# EAGLE design ArcadeTouchPanel5 (EAGLE 9.6.2)
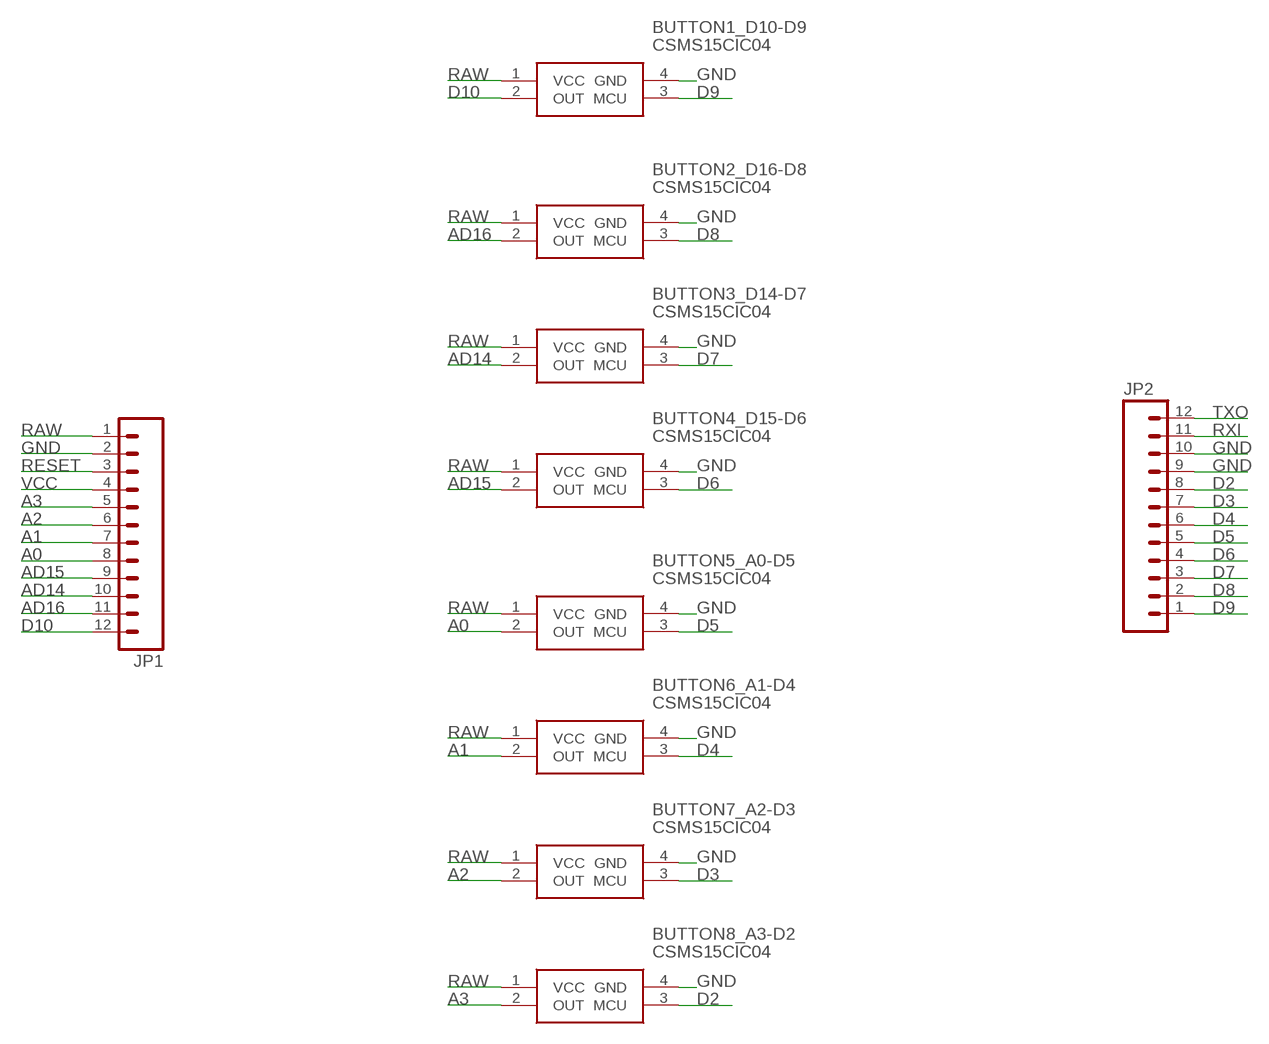
[diagram p0: schematic, sheet 1]

## Parts
BUTTON1_D10-D9  CSMS15CIC04  [CSMS15CIC04]
BUTTON2_D16-D8  CSMS15CIC04  [CSMS15CIC04]
BUTTON3_D14-D7  CSMS15CIC04  [CSMS15CIC04]
BUTTON4_D15-D6  CSMS15CIC04  [CSMS15CIC04]
BUTTON5_A0-D5  CSMS15CIC04  [CSMS15CIC04]
BUTTON6_A1-D4  CSMS15CIC04  [CSMS15CIC04]
BUTTON7_A2-D3  CSMS15CIC04  [CSMS15CIC04]
BUTTON8_A3-D2  CSMS15CIC04  [CSMS15CIC04]
JP1  M12PTH  [1X12]
JP2  M12PTH  [1X12]

## Nets
A0: BUTTON5_A0-D5.2(OUT) JP1.8
A1: BUTTON6_A1-D4.2(OUT) JP1.7
A2: BUTTON7_A2-D3.2(OUT) JP1.6
A3: BUTTON8_A3-D2.2(OUT) JP1.5
AD14: BUTTON3_D14-D7.2(OUT) JP1.10
AD15: BUTTON4_D15-D6.2(OUT) JP1.9
AD16: BUTTON2_D16-D8.2(OUT) JP1.11
D2: BUTTON8_A3-D2.3(MCU) JP2.8
D3: BUTTON7_A2-D3.3(MCU) JP2.7
D4: BUTTON6_A1-D4.3(MCU) JP2.6
D5: BUTTON5_A0-D5.3(MCU) JP2.5
D6: BUTTON4_D15-D6.3(MCU) JP2.4
D7: BUTTON3_D14-D7.3(MCU) JP2.3
D8: BUTTON2_D16-D8.3(MCU) JP2.2
D9: BUTTON1_D10-D9.3(MCU) JP2.1
D10: BUTTON1_D10-D9.2(OUT) JP1.12
GND [vcc]: BUTTON1_D10-D9.4(GND) BUTTON2_D16-D8.4(GND) BUTTON3_D14-D7.4(GND) BUTTON4_D15-D6.4(GND) BUTTON5_A0-D5.4(GND) BUTTON6_A1-D4.4(GND) BUTTON7_A2-D3.4(GND) BUTTON8_A3-D2.4(GND) JP1.2 JP2.9 JP2.10
RAW [vcc]: BUTTON1_D10-D9.1(VCC) BUTTON2_D16-D8.1(VCC) BUTTON3_D14-D7.1(VCC) BUTTON4_D15-D6.1(VCC) BUTTON5_A0-D5.1(VCC) BUTTON6_A1-D4.1(VCC) BUTTON7_A2-D3.1(VCC) BUTTON8_A3-D2.1(VCC) JP1.1
RESET: JP1.3
RXI: JP2.11
TXO: JP2.12
VCC: JP1.4

## Library data of the parts
BUTTON1_D10-D9 BUTTON2_D16-D8 BUTTON3_D14-D7 BUTTON4_D15-D6 BUTTON5_A0-D5 BUTTON6_A1-D4 BUTTON7_A2-D3 BUTTON8_A3-D2 = SamacSys_Parts:CSMS15CIC04: VCC (VISUAL COMMUNICATIONS COMPANY) - CSMS15CIC04 - CAPACITIVE TOUCH SENSOR DISPLAY, WHITE Source: Datasheet <https://www.vcclite.com/wp-content/uploads/wpallimport/files/files/CSMS15CIC04.pdf>; DESCRIPTION: VCC (VISUAL COMMUNICATIONS COMPANY) - CSMS15CIC04 - CAPACITIVE TOUCH SENSOR DISPLAY, WHITE; HEIGHT: 3.2mm; MANUFACTURER_NAME: Visual Communications Company; MANUFACTURER_PART_NUMBER: CSMS15CIC04; MOUSER_PART_NUMBER: 593-CSMS15CIC04; MOUSER_PRICE-STOCK: https://www.mouser.co.uk/ProductDetail/VCC/CSMS15CIC04?qs=rrS6PyfT74cZ9SgyWmzvNQ%3D%3D
JP1 JP2 = SparkFun:M12: Header 12 Standard 12-pin 0.1" header. Use with straight break away headers (SKU : PRT-00116), right angle break away headers (PRT-00553), swiss pins (PRT-00743), machine pins (PRT-00117), and female headers (PRT-00115).

## Net classes
0 default: width 0.203 mm

## Board
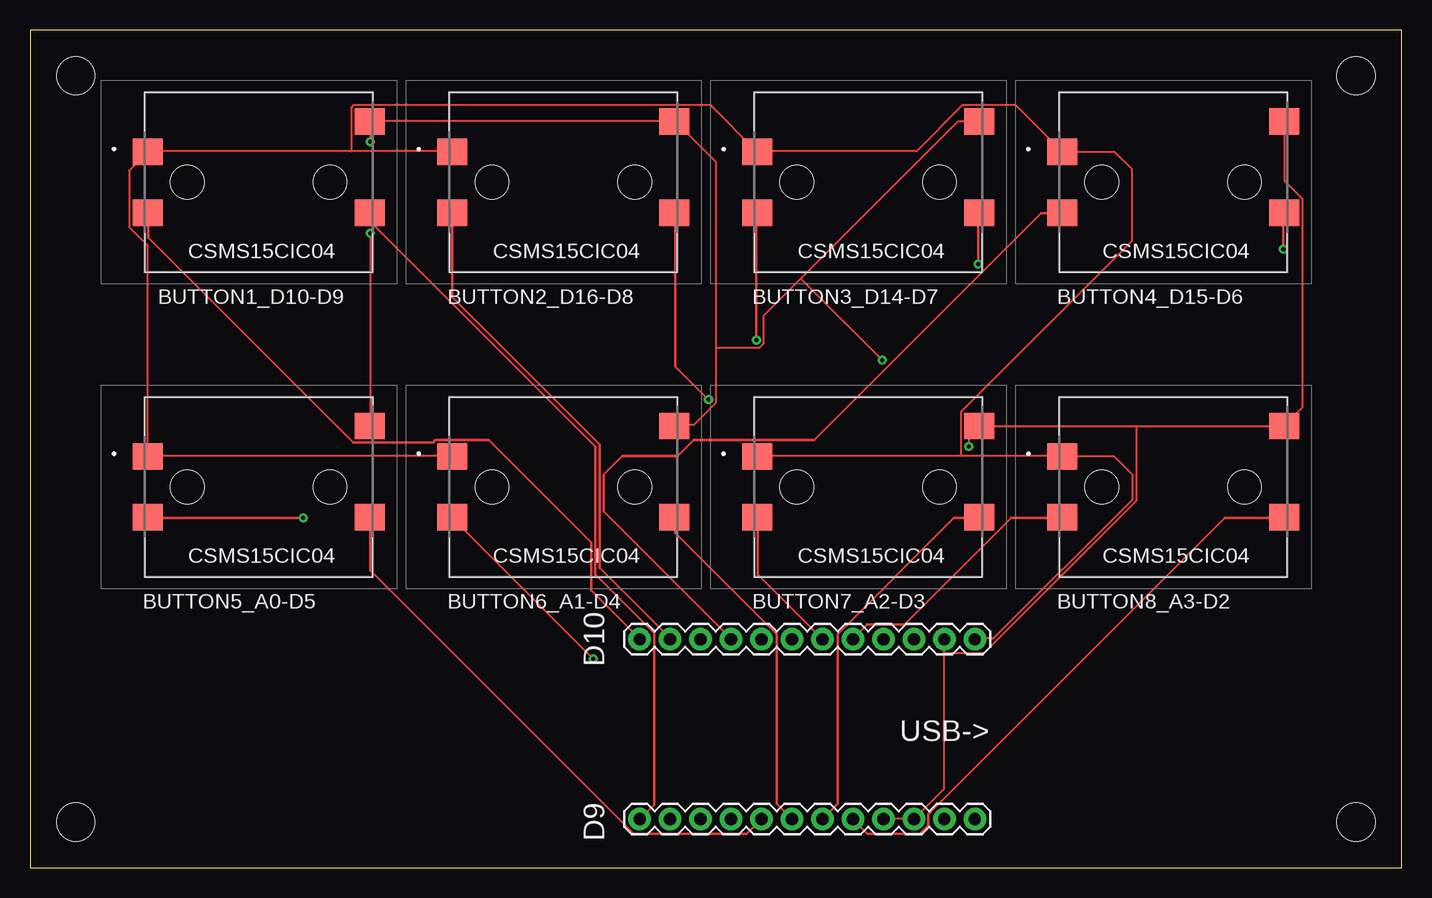
[diagram p1: board, top side]
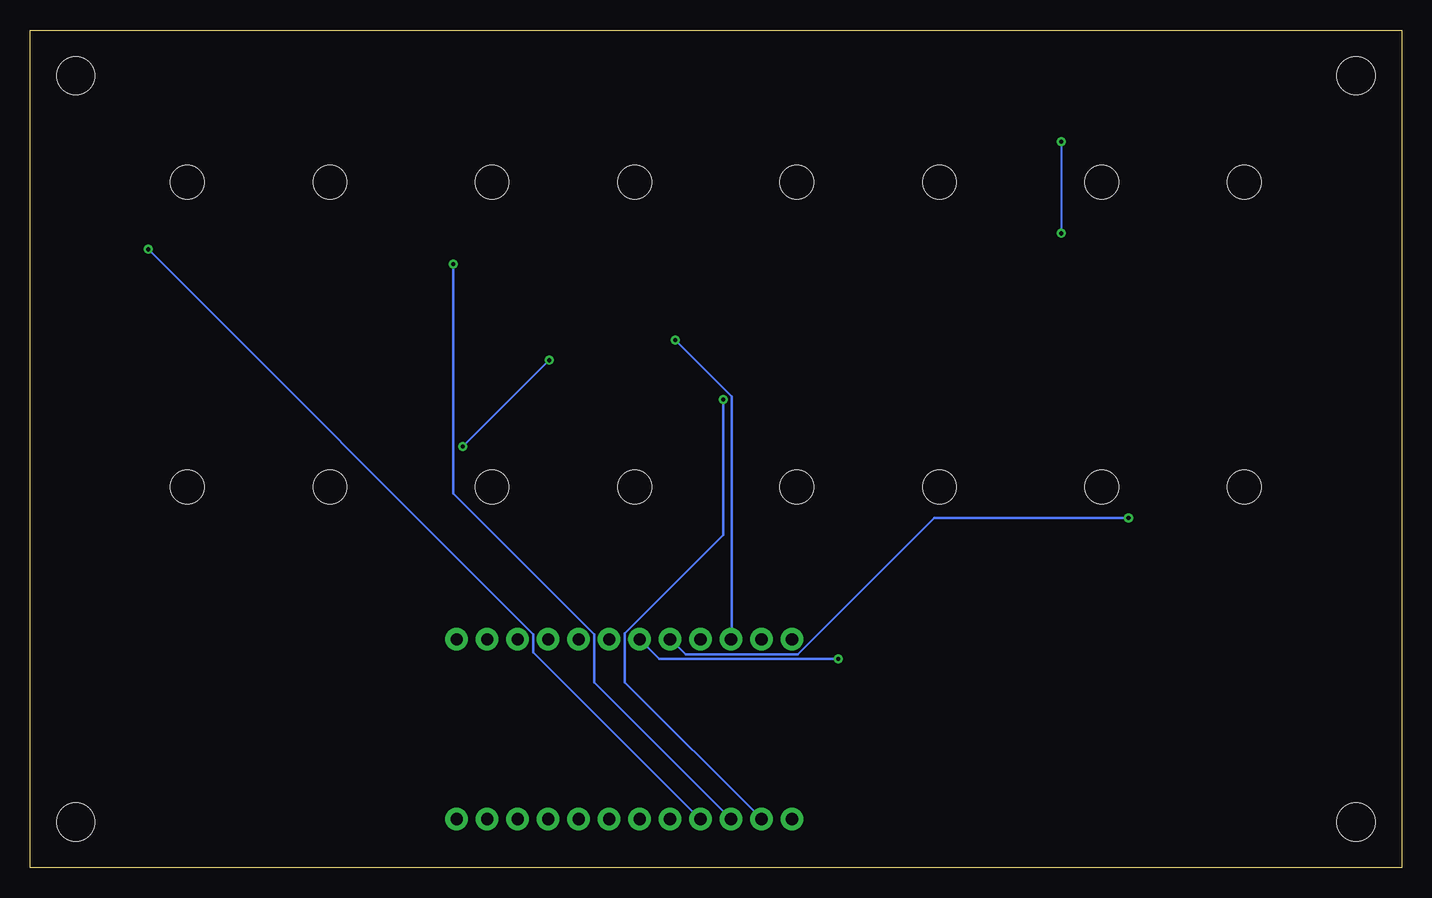
[diagram p2: board, bottom side, seen from below]

Size 114.3 x 69.85 mm. Coordinates in mm from the lower left corner, seen from the top.
Outline: 0,0 114.3,0 114.3,69.85 0,69.85 0,0
Copper layers (1*16): Top 0.035mm / dielectric 1.5mm / Bottom 0.035mm
Design rules "default": minimum track width 6mil, minimum drill 0.35mm, track to track 6mil, track to pad 6mil, pad to pad 6mil, via to via 6mil, smd to smd 6mil, copper to edge 40mil, drill to drill 6mil, minimum pad ring 10mil, minimum via ring 8mil, stop-mask expansion 4mil, vias tented up to drill 0mil, thermal gap 10mil
Holes 3.17 mm at 3.81,66.04 110.49,66.04 110.49,3.81 3.81,3.81

### Footprints (pad centres in the part's own frame; a part is rotated, then mirrored left to right if it is on the bottom)
CSMS15CIC04 = smd 2.5 x 2.2: 1 -9.25,2.54; 2 -9.25,-2.54; 3 9.25,-2.54; 4 9.25,5.08 | hole 2.8: -5.95,0; 5.95,0
1X12 = drill 1.016 pad 1.88: 1 0,0; 2 2.54,0; 3 5.08,0; 4 7.62,0; 5 10.16,0; 6 12.7,0; 7 15.24,0; 8 17.78,0; 9 20.32,0; 10 22.86,0; 11 25.4,0; 12 27.94,0

### Placement (x,y rotation side)
BUTTON1_D10-D9  19.05,57.15 0 top
BUTTON2_D16-D8  44.45,57.15 0 top
BUTTON3_D14-D7  69.85,57.15 0 top
BUTTON4_D15-D6  95.25,57.15 0 top
BUTTON5_A0-D5  19.05,31.75 0 top
BUTTON6_A1-D4  44.45,31.75 0 top
BUTTON7_A2-D3  69.85,31.75 0 top
BUTTON8_A3-D2  95.25,31.75 0 top
JP1  78.74,19.05 180 top
JP2  50.8,4.06 0 top

### Tracks (layer width: path | path; a pad name or v marks a point on that pad's centre or on a via)
A0  (via drill 0.35)
  Top 0.203: v22.76,29.16 9.87,29.16 BUTTON5_A0-D5.2
  Bottom 0.203: v22.76,29.16 38.94,29.16 50.32,17.78 59.65,17.78 60.9,19.02 JP1.8
A1  (via drill 0.35)
  Top 0.203: v46.94,17.42 35.2,29.16 BUTTON6_A1-D4.2
  Bottom 0.203: v46.94,17.42 61.87,17.42 JP1.7
A2
  Top 0.203: BUTTON7_A2-D3.2 60.63,29.16 60.63,24.45 65.96,19.11 JP1.6
A3
  Top 0.203: BUTTON8_A3-D2.2 85.97,29.16 81.79,29.16 72.9,20.27 69.79,20.27 68.63,19.11 JP1.5
AD14  (via drill 0.35)
  Top 0.203: v60.54,44.01 60.54,54.59 BUTTON3_D14-D7.2
  Bottom 0.203: v60.54,44.01 55.83,39.29 55.83,19.11 JP1.10
AD15
  Top 0.203: BUTTON4_D15-D6.2 85.97,54.59 84.28,54.59 65.34,35.65 55.3,35.65 53.96,34.31 49.34,34.31 47.83,32.8 47.83,29.69 58.41,19.11 JP1.9
AD16
  Top 0.203: BUTTON2_D16-D8.2 35.2,54.59 35.2,47.56 47.47,35.29 47.47,24.98 53.34,19.11 JP1.11
D2
  Top 0.203: BUTTON8_A3-D2.3 104.46,29.16 99.57,29.16 74.85,4.45 74.85,3.56 74.14,2.85 69.79,2.85 68.63,4 JP2.8
D3
  Top 0.203: BUTTON7_A2-D3.3 79.03,29.16 76.99,29.16 67.3,19.47 67.3,5.33 66.05,4.09 JP2.7
D4
  Top 0.203: JP2.6 62.23,5.33 62.23,19.47 53.78,27.91 53.78,29.16 BUTTON6_A1-D4.3
D5
  Top 0.203: JP2.5 59.74,2.85 50.32,2.85 28.36,24.8 28.36,29.16 BUTTON5_A0-D5.3
D6  (via drill 0.35)
  Top 0.203: v104.46,51.56 104.46,54.59 BUTTON4_D15-D6.3
  Bottom 0.203: v104.46,51.56 72.36,19.47 72.36,17.96 58.5,4.09 JP2.4
D7  (via drill 0.35)
  Top 0.203: v79.03,50.32 79.03,54.59 BUTTON3_D14-D7.3
  Bottom 0.203: v79.03,50.32 79.03,31.2 67.3,19.47 67.3,15.47 55.92,4.09 JP2.3
D8  (via drill 0.35)
  Top 0.203: v56.54,39.03 53.78,41.78 53.78,54.59 BUTTON2_D16-D8.3
  Bottom 0.203: v56.54,39.03 56.54,27.74 64.72,19.56 64.72,15.47 53.34,4.09 JP2.2
D9
  Top 0.203: BUTTON1_D10-D9.3 28.36,54.59 28.36,53.87 47.12,35.12 47.12,24.45 52.01,19.56 52.01,5.25 50.85,4.09 JP2.1
D10
  Top 0.203: BUTTON1_D10-D9.2 9.87,54.59 9.87,52.54 26.94,35.47 33.6,35.47 33.78,35.65 38.23,35.65 46.76,27.11 46.76,23.11 50.76,19.11 JP1.12
GND  (via drill 0.35)
  Top 0.152: v28.36,52.9 28.36,36.89 BUTTON5_A0-D5.4 | 28.36,62.23 v28.36,60.54 | 57.16,43.38 57.16,58.85 53.78,62.23 BUTTON2_D16-D8.4 28.36,62.23 | 57.16,43.38 57.16,38.76 55.3,36.89 53.78,36.89 BUTTON6_A1-D4.4 | BUTTON3_D14-D7.4 77.34,62.23 64.23,49.12 | 64.23,49.12 61.16,46.05 61.16,43.74 60.81,43.38 57.16,43.38 | 28.36,62.23 BUTTON1_D10-D9.4 | JP2.9 71.12,4.09 73.61,4.09 JP2.10 73.7,4.09 76.19,6.58 76.19,17.87 | 76.19,17.87 76.19,19.02 JP1.2 | 92.19,36.8 104.46,36.8 BUTTON8_A3-D2.4 104.55,36.89 106.06,38.41 106.06,55.74 104.55,57.25 104.55,62.23 BUTTON4_D15-D6.4 | 92.19,36.8 79.12,36.8 BUTTON7_A2-D3.4 79.03,36.8 78.23,36.01 v78.23,35.12 | 76.19,17.87 79.48,17.87 92.19,30.58 92.19,36.8 | v71.03,42.32 64.23,49.12
  Bottom 0.152: v28.36,60.54 v28.36,52.9 | v78.23,35.12 v71.03,42.32
RAW
  Top 0.152: BUTTON6_A1-D4.1 35.12,34.31 9.87,34.31 BUTTON5_A0-D5.1 9.78,34.31 9.78,51.92 8.27,53.43 8.27,58.14 9.78,59.65 BUTTON1_D10-D9.1 9.87,59.74 26.76,59.74 | 26.76,59.74 35.12,59.74 BUTTON2_D16-D8.1 | 77.61,34.31 85.97,34.31 BUTTON8_A3-D2.1 86.06,34.31 90.32,34.31 91.83,32.8 91.83,30.67 80.28,19.11 78.77,19.11 JP1.1 | 77.61,34.31 60.63,34.31 BUTTON7_A2-D3.1 | 77.61,34.31 77.61,38.05 91.83,52.27 91.83,58.23 90.41,59.65 86.06,59.65 BUTTON4_D15-D6.1 85.97,59.74 82.14,63.56 77.7,63.56 73.88,59.74 60.63,59.74 BUTTON3_D14-D7.1 60.54,59.74 56.72,63.56 26.94,63.56 26.76,63.39 26.76,59.74

### Text on the board
tNames: D10 | USB-> | D9